# Altium schematic sheet Sheet3.SchDoc
size A3
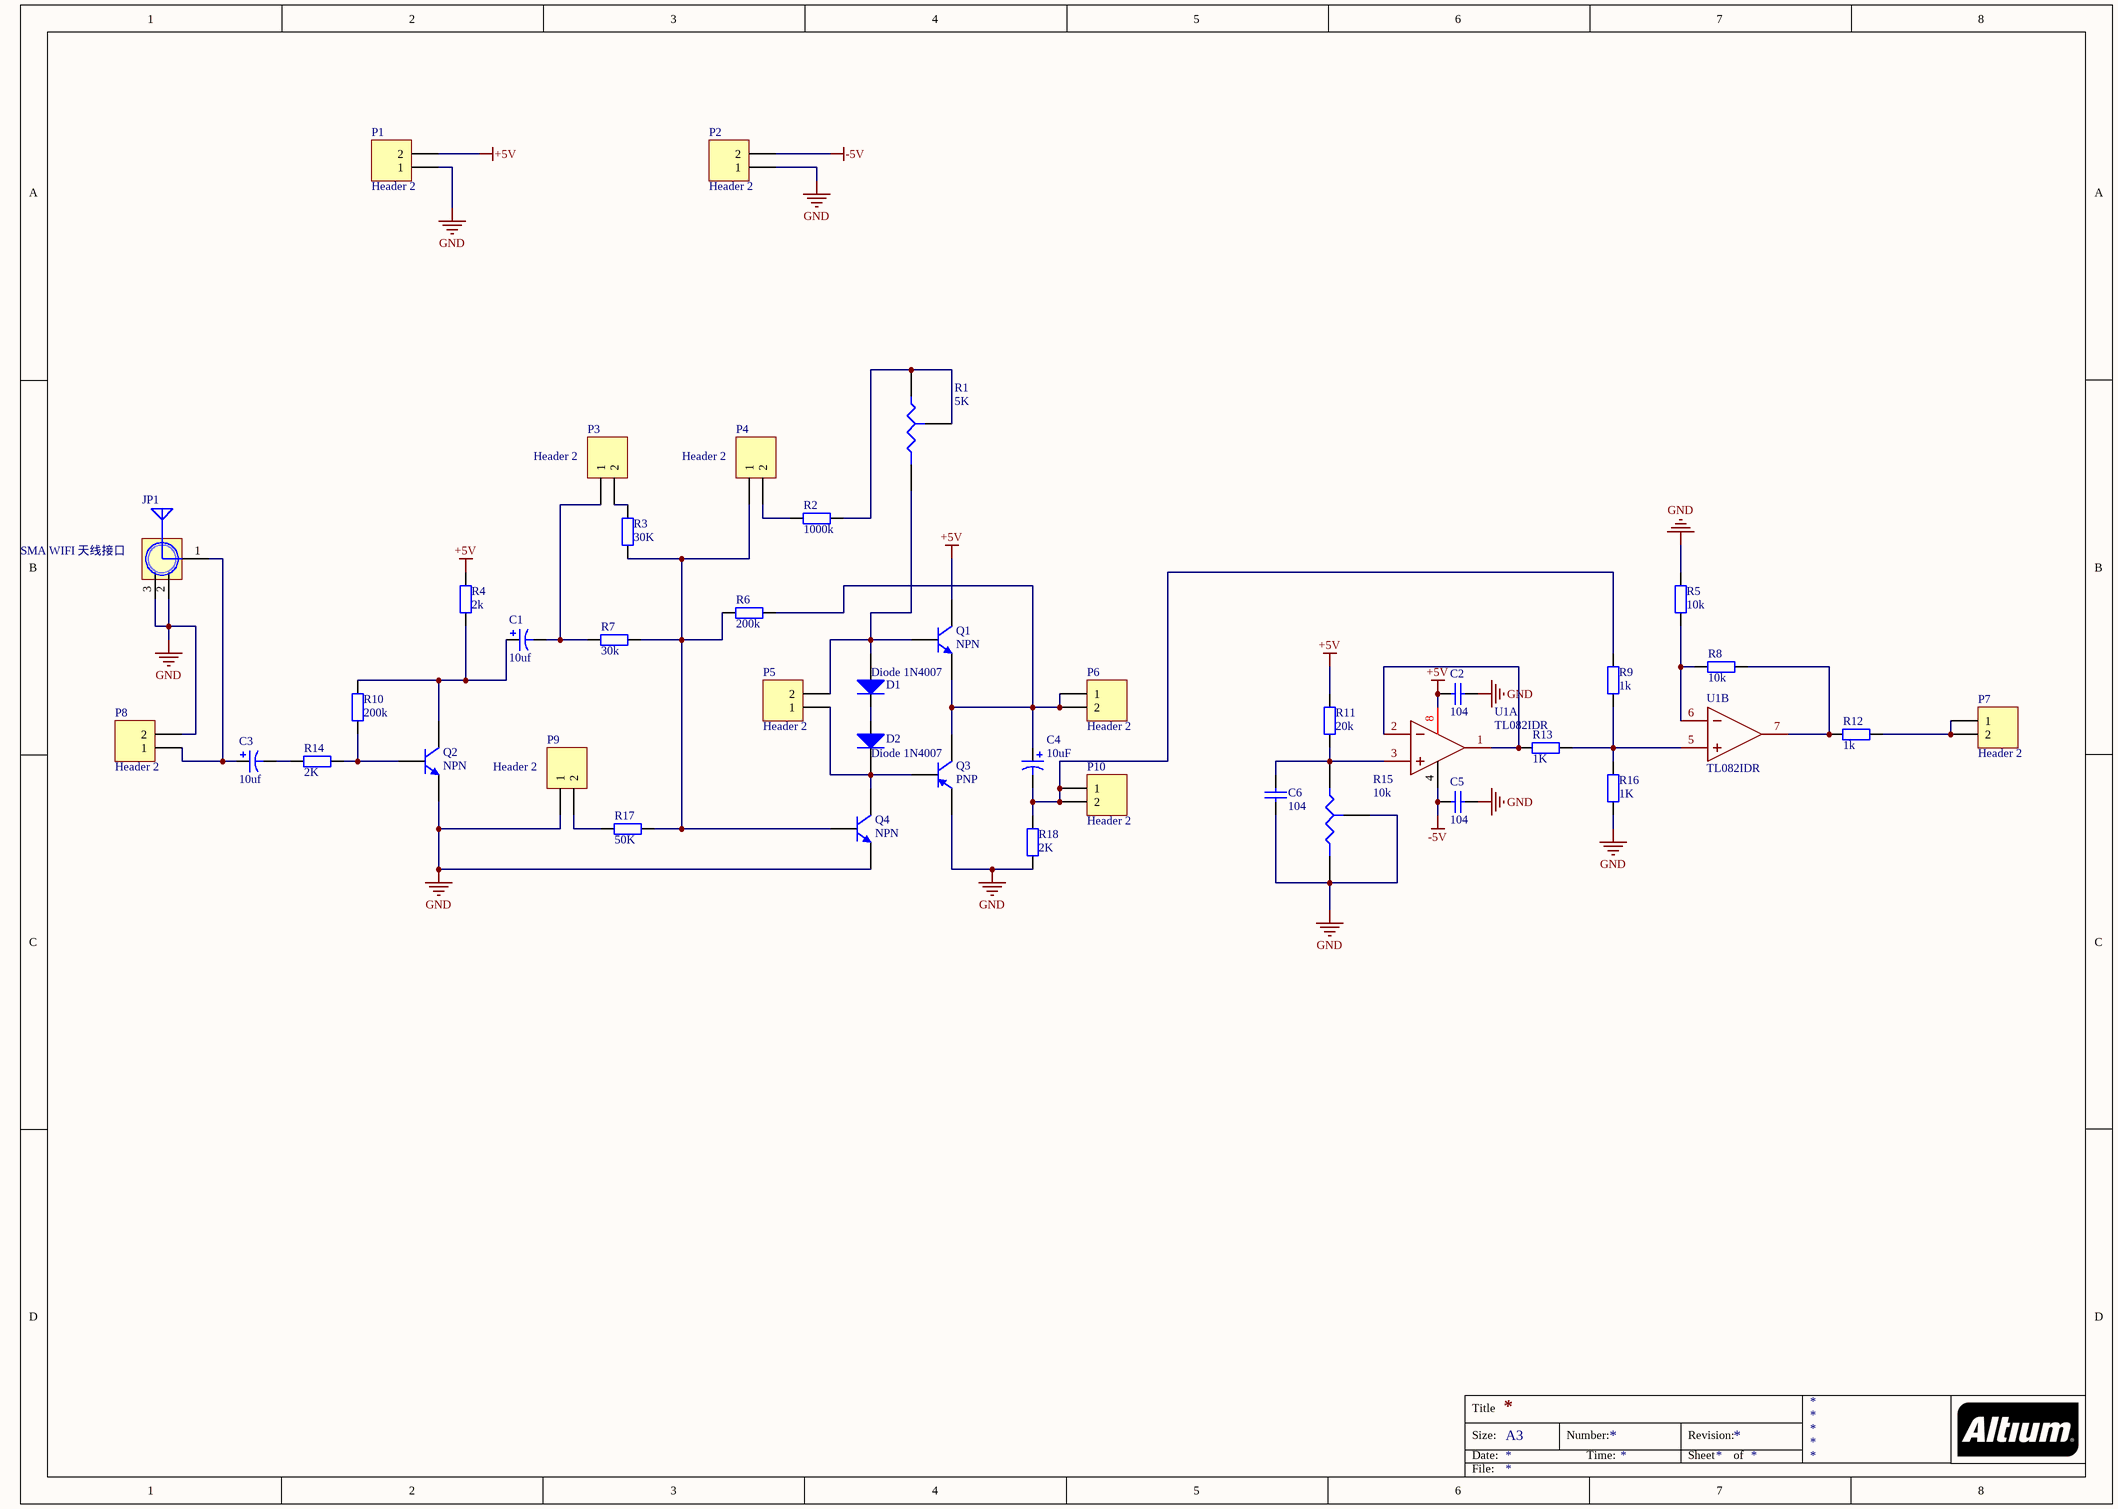
[diagram p0: Sheet3.SchDoc]

## Parts
C1  10uf  [CAP 5.0*10*16 - BK]
C2  104  [CC 2.2*5]
C3  10uf  [CAP 5.0*10*16 - BK]
C4  10uF  [CAP 5.0*10*16 - BK]
C5  104  [CC 2.2*5]
C6  104  [CC 2.2*5]
D1  Diode 1N4007  [DO-41]
D2  Diode 1N4007  [DO-41]
JP1  SMA WIFI 天线接口  [SMA-KE-LI]
P1  Header 2  [XH2.54-LI-2P]
P2  Header 2  [XH2.54-LI-2P]
P3  Header 2  [XH2.54-LI-2P]
P4  Header 2  [XH2.54-LI-2P]
P5  Header 2  [XH2.54-LI-2P]
P6  Header 2  [HDR2.54-LI-2P]
P7  Header 2  [XH2.54-LI-2P]
P8  Header 2  [XH2.54-LI-2P]
P9  Header 2  [XH2.54-LI-2P]
P10  Header 2  [XH2.54-LI-2P]
Q1  NPN  [TO92]
Q2  NPN  [TO92]
Q3  PNP  [TO92]
Q4  NPN  [TO92]
R1  5K  [3296W]
R2  1000k  [AXIAL0.4-1/4W]
R3  30K  [AXIAL0.4-1/4W]
R4  2k  [AXIAL0.4-1/4W]
R5  10k  [AXIAL0.4-1/4W]
R6  200k  [AXIAL0.4-1/4W]
R7  30k  [AXIAL0.4-1/4W]
R8  10k  [AXIAL0.4-1/4W]
R9  1k  [AXIAL0.4-1/4W]
R10  200k  [AXIAL0.4-1/4W]
R11  20k  [AXIAL0.4-1/4W]
R12  1k  [AXIAL0.4-1/4W]
R13  1K  [AXIAL0.4-1/4W]
R14  2K  [AXIAL0.4-1/4W]
R15  10k  [3296W]
R16  1K  [AXIAL0.4-1/4W]
R17  50K  [AXIAL0.4-1/4W]
R18  2K  [AXIAL0.4-1/4W]
U1  TL082IDR  [DIP8-300_MH]  (parts A,B of 2)

## Nets
+5V: C2.2 P1.2 Q1.1(C) R4.1 R11.2 U1.8(VCC+)
-5V: C5.2 P2.2 U1.4(VCC-)
GND: C2.1 C5.1 C6.1 JP1.2(GND) JP1.3(GND) P1.1 P2.1 P8.2 P9.1 Q2.3(E) Q3.3(E) Q4.3(E) R5.1 R15.2(B) R15.3(TAP) R16.1 R18.2
NetC1_1: C1.1 Q2.1(C) R4.2 R10.2
NetC1_2: C1.2 P3.1 R7.2
NetC3_1: C3.1 JP1.1(ANT) P8.1
NetC3_2: C3.2 R14.1
NetC4_1: C4.1 P6.1 P6.2 Q1.3(E) Q3.1(C) R6.1
NetC4_2: C4.2 P10.1 P10.2 R9.2 R18.1
NetC6_2: C6.2 R11.1 R15.1(A) U1.3(IN1+)
NetD1_1: D1.1(A) P5.2 Q1.2(B) R1.2(B)
NetD1_2: D1.2(K) D2.1(A)
NetD2_2: D2.2(K) P5.1 Q3.2(B) Q4.1(C)
NetP3_2: P3.2 R3.2
NetP4_1: P4.1 Q4.2(B) R3.1 R6.2 R7.1 R17.2
NetP4_2: P4.2 R2.1
NetP7_1: P7.1 P7.2 R12.1
NetP9_2: P9.2 R17.1
NetQ2_2: Q2.2(B) R10.1 R14.2
NetR1_1: R1.1(A) R1.3(TAP) R2.2
NetR5_2: R5.2 R8.2 U1.6(IN2-)
NetR8_1: R8.1 R12.2 U1.7(OUT2)
NetR9_1: R9.1 R13.2 R16.2 U1.5(IN2+)
NetR13_1: R13.1 U1.1(OUT1) U1.2(IN1-)

## Notes on the sheet
- Title
- Size:
- Date:
- A3
- Number:
- Time:
- Revision:
- Sheet
- of
- File:

## Library data of the parts
C1 C3 C4 = Cap Pol1: Polarized Capacitor (Radial); Value: 100pF; Published: 8-Jun-2000; LatestRevisionDate: 17-Jul-2002; LatestRevisionNote: Re-released for DXP Platform.; PackageReference: RB7.6-15; Publisher: Altium Limited; PackageDescription: Polarized Capacitor (Radial); 2 Leads
C2 C5 C6 = Cap: Capacitor; Value: 100pF; Published: 8-Jun-2000; LatestRevisionDate: 17-Jul-2002; LatestRevisionNote: Re-released for DXP Platform.; PackageReference: RAD-0.3; Publisher: Altium Limited; PackageDescription: Radial Cap, Thru-Hole; 2 Leads; 0.3 in Pin Spacing
D1 D2 = Diode 1N4007: 1 Amp General Purpose Rectifier; Published: 8-Jun-2000; LatestRevisionDate: 17-Jul-2002; LatestRevisionNote: Re-released for DXP Platform.; DatasheetVersion: 1998; PackageVersion: Aug-1999; PackageReference: DO-41; Publisher: Altium Limited; PackageDescription: Diode, Axial; Body 5.2 x 2.7 mm (LxDia. max), Lead Dia. 0.86 mm (max); Code_JEDEC: DO-204-AL; ComponentLink1Description: Manufacturer Link; ComponentLink1URL: http://www.fairchildsemi.com/; ComponentLink2Description: Datasheet; ComponentLink2URL: http://www.fairchildsemi.com/ds/1N%2F1N4001.pdf
JP1 = SMA: SMA-2.4G射频天线接口; 版权归属: 源创客; BOM名称: SMA-2.4G射频天线接口; 学习资源: www.ooocke.com
P1-P10 = Header 2: Header, 2-Pin; LatestRevisionDate: 17-Jul-2002; LatestRevisionNote: Re-released for DXP Platform.; Publisher: Altium Limited
Q1 Q2 Q4 = NPN: NPN Bipolar Transistor; Published: 8-Jun-2000; LatestRevisionDate: 17-Jul-2002; LatestRevisionNote: Re-released for DXP Platform.; PackageReference: TO-226-AA; Publisher: Altium Limited; PackageDescription: TO, Flat Index; 3 In-Line, Axial Leads; Body Dia. 4.8mm; Leads 0.55 x 0.51 mm (max); Code_JEDEC: TO-226-AA
Q3 = PNP: PNP Bipolar Transistor; Published: 8-Jun-2000; LatestRevisionDate: 29-May-2009; LatestRevisionNote: IPC-7351 Footprint Added.; PackageVersion: Aug-1999; PackageReference: SOT-23B; Publisher: Altium Limited; PackageDescription: 3-Pin SOT-23 Package 0.95 mm Pitch, 2.4 mm Lead Span
R1 R15 = Res Tap: Tapped Resistor; Sim Note: Enter the Resistance value and the set point into parameter fields.; Set Position: 0.5; Value: 1K; Published: 24-Mar-1999; LatestRevisionDate: 17-Jul-2002; LatestRevisionNote: Re-released for DXP Platform.; PackageReference: VR3; Publisher: Altium Limited; PackageDescription: Variable Resistor, Thru-Hole; 3 Leads
R2-R8 R10 R11 R14 R17 R18 = Res2: Resistor; Value: 1K; Published: 8-Jun-2000; LatestRevisionDate: 17-Jul-2002; LatestRevisionNote: Re-released for DXP Platform.; PackageReference: AXIAL-0.4; Publisher: Altium Limited; PackageDescription: Axial Device, Thru-Hole; 2 Leads; 0.4 in Pin Spacing
R9 R12 R13 R16 = Res2: Resistor; Published: 8-Jun-2000; LatestRevisionDate: 17-Jul-2002; LatestRevisionNote: Re-released for DXP Platform.; PackageReference: AXIAL-0.4; Publisher: Altium Limited; PackageDescription: Axial Device, Thru-Hole; 2 Leads; 0.4 in Pin Spacing; Value: 1K
U1 = TL082IDR: Num:C6966